# EAGLE design WattMeter_v4 (EAGLE 9.0.0)
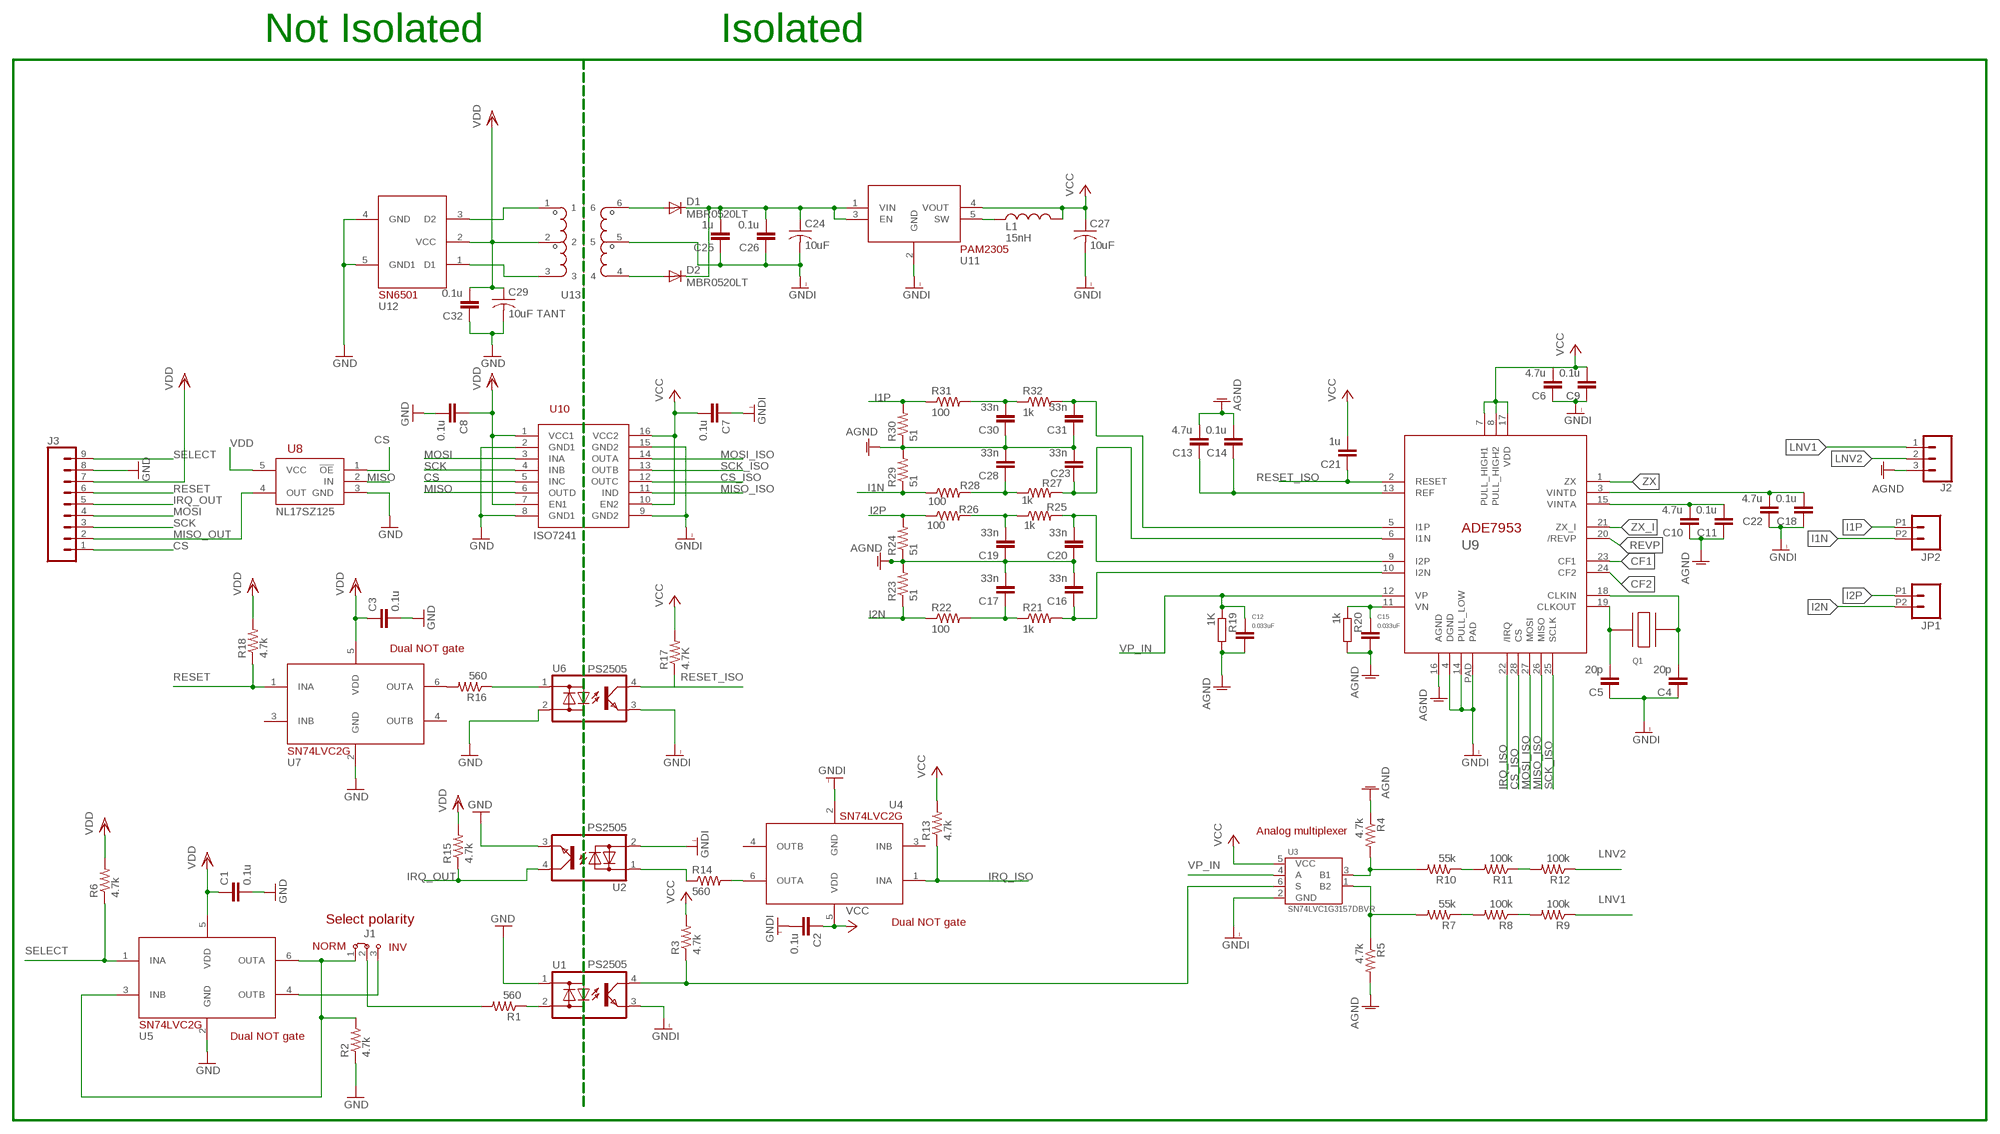
[diagram p0: schematic, sheet 1]

## Parts
C1  0.1u  0402-CAP  [0402-CAP]
C2  0.1u  0402-CAP  [0402-CAP]
C3  0.1u  0402-CAP  [0402-CAP]
C4  20p  0402-CAP  [0402-CAP]
C5  20p  0402-CAP  [0402-CAP]
C6  4.7u  0402-CAP  [0402-CAP]
C7  0.1u  0402-CAP  [0402-CAP]
C8  0.1u  0402-CAP  [0402-CAP]
C9  0.1u  0402-CAP  [0402-CAP]
C10  4.7u  0402-CAP  [0402-CAP]
C11  0.1u  0402-CAP  [0402-CAP]
C12  0.033uF  C-EUC0805K  [C0805K]
C13  4.7u  0402-CAP  [0402-CAP]
C14  0.1u  0402-CAP  [0402-CAP]
C15  0.033uF  C-EUC0805K  [C0805K]
C16  33n  0402-CAP  [0402-CAP]
C17  33n  0402-CAP  [0402-CAP]
C18  0.1u  0402-CAP  [0402-CAP]
C19  33n  0402-CAP  [0402-CAP]
C20  33n  0402-CAP  [0402-CAP]
C21  1u  0402-CAP  [0402-CAP]
C22  4.7u  0402-CAP  [0402-CAP]
C23  33n  0402-CAP  [0402-CAP]
C24  10uF  C-USC0603  [C0603]
C25  1u  0402-CAP  [0402-CAP]
C26  0.1u  0402-CAP  [0402-CAP]
C27  10uF  C-USC0603  [C0603]
C28  33n  0402-CAP  [0402-CAP]
C29  10uF TANT  C-USC0603  [C0603]
C30  33n  0402-CAP  [0402-CAP]
C31  33n  0402-CAP  [0402-CAP]
C32  0.1u  0402-CAP  [0402-CAP]
D1  MBR0520LT  [SOD123]
D2  MBR0520LT  [SOD123]
J1  JUMPER3  [1X03]
J2  CONN_03-SCREW-5MM  [SCREWTERMINAL-5MM-3]
J3  CONN_09  [1X09]
JP1  M022.54MM_SCREWTERM  [1X02_2.54_SCREWTERM]
JP2  M022.54MM_SCREWTERM  [1X02_2.54_SCREWTERM]
L1  15nH  IND0402  [0402-RES]
Q1  QUARTZ_3.58M_2PIN  [HC-49S]
R1  560  0402-RES  [0402-RES]
R2  4.7k  0402-RES  [0402-RES]
R3  4.7k  0402-RES  [0402-RES]
R4  4.7k  RESISTOR0603-RES  [0603-RES]
R5  4.7k  RESISTOR0603-RES  [0603-RES]
R6  4.7k  0402-RES  [0402-RES]
R7  55k  RESISTOR0603-RES  [0603-RES]
R8  100k  RESISTOR0603-RES  [0603-RES]
R9  100k  RESISTOR0603-RES  [0603-RES]
R10  55k  RESISTOR0603-RES  [0603-RES]
R11  100k  RESISTOR0603-RES  [0603-RES]
R12  100k  RESISTOR0603-RES  [0603-RES]
R13  4.7k  0402-RES  [0402-RES]
R14  560  0402-RES  [0402-RES]
R15  4.7k  0402-RES  [0402-RES]
R16  560  0402-RES  [0402-RES]
R17  4.7K  0402-RES  [0402-RES]
R18  4.7k  0402-RES  [0402-RES]
R19  1K  R-EU_  [C0805K@1]
R20  1k  R-EU_  [C0805K@1]
R21  1k  0402-RES  [0402-RES]
R22  100  0402-RES  [0402-RES]
R23  51  0402-RES  [0402-RES]
R24  51  0402-RES  [0402-RES]
R25  1k  0402-RES  [0402-RES]
R26  100  0402-RES  [0402-RES]
R27  1k  0402-RES  [0402-RES]
R28  100  0402-RES  [0402-RES]
R29  51  0402-RES  [0402-RES]
R30  51  0402-RES  [0402-RES]
R31  100  0402-RES  [0402-RES]
R32  1k  0402-RES  [0402-RES]
U1  PS2505  [PS2505]
U2  PS2505  [PS2505]
U3  SN74LVC1G3157DBVR  [SOT-23-6]
U4  SN74LVC  [DCKT]
U5  SN74LVC  [DCKT]
U6  PS2505  [PS2505]
U7  SN74LVC  [DCKT]
U8  NL17SZ125  [NL17SZ125]
U9  ADE7953  [28-WFQFN]
U10  ISO7241  [16-SOIC]
U11  PAM2305  [TSOT25]
U12  SN6501  [SOT-23-5]
U13  TRANSFO_3.3  [TRANSFO_3.3]

## Nets
AGND: C10.1 C11.1 C12.2 C13.2 C14.2 C15.2 C16.2 C17.2 C19.1 C20.1 C23.2 C28.2 C30.1 C31.1 J2.3 R4.1 R5.2 R19.2 R20.2 R23.2 R24.1 R29.2 R30.1 U9.16(AGND)
CF1: U9.23(CF1)
CF2: U9.24(CF2)
CS: J3.1 U8.1(!OE) U10.5(INC)
CS_ISO: U9.28(CS) U10.12(OUTC)
GND: C1.2 C3.2 C8.2 C29.2 C32.1 J3.8 R2.1 U1.1(ANODE) U2.3(EMITTER) U5.2(GND) U6.2(CATHODE) U7.2(GND) U8.3(GND) U10.2(GND1) U10.8(GND1) U12.4(GND) U12.5(GND1)
GNDI: C2.2 C4.1 C5.1 C6.1 C7.1 C9.1 C18.1 C22.1 C24.2 C25.1 C26.1 C27.2 U1.3(EMITTER) U2.2(CATHODE) U3.2(GND) U4.2(GND) U6.3(EMITTER) U9.4(DGND) U9.14(PULL_LOW) U9.PAD U10.9(GND2) U10.15(GND2) U11.2(GND) U13.5
I1N: JP2.P2 R28.1 R29.1
I1P: JP2.P1 R30.2 R31.1
I2N: JP1.P2 R22.1 R23.1
I2P: JP1.P1 R24.2 R26.1
IRQ_ISO: R13.1 U4.1(INA) U9.22(/IRQ)
IRQ_OUT: J3.5 R15.1 U2.4(COLLERTOR)
LNV1: J2.1 R9.1
LNV2: J2.2 R12.1
MISO: U8.2(IN) U10.6(OUTD)
MISO_ISO: U9.26(MISO) U10.11(IND)
MISO_OUT: J3.2 U8.4(OUT)
MOSI: J3.4 U10.3(INA)
MOSI_ISO: U9.27(MOSI) U10.14(OUTA)
N$1: C5.2 Q1.1 U9.19(CLKOUT)
N$2: C4.2 Q1.2 U9.18(CLKIN)
N$3 [ic]: C15.1 R20.1 U9.11(VN)
N$4: L1.1 U11.5(SW)
N$7: C13.1 C14.1 U9.13(REF)
N$8: C10.2 C11.2 U9.15(VINTA)
N$10: C23.1 R27.2 U9.6(I1N)
N$11: C31.2 R32.2 U9.5(I1P)
N$12: C18.2 C22.2 U9.3(VINTD)
N$13: R8.1 R9.2
N$17: J1.3 U5.4(OUTB)
N$18: D1.A U13.6
N$19: C24.1 C25.2 C26.2 D1.C D2.C U11.1(VIN) U11.3(EN)
N$20: D2.A U13.4
N$21: U12.3(D2) U13.1
N$22: R7.1 R8.2
N$23: U12.1(D1) U13.3
N$24: C30.2 R31.2 R32.1
N$25: R16.1 U6.1(ANODE)
N$26: R16.2 U7.6(OUTA)
N$27: C28.1 R27.1 R28.2
N$28: C16.1 R21.2 U9.10(I2N)
N$30: R14.2 U4.6(OUTA)
N$32: C20.2 R25.2 U9.9(I2P)
N$33: C19.2 R25.1 R26.2
N$34: C17.1 R21.1 R22.2
N$35: R11.1 R12.2
N$36: R10.1 R11.2
N$37: R5.1 R7.2 U3.1(B2)
N$38: R4.2 R10.2 U3.3(B1)
N$39: R14.1 U2.1(ANODE)
N$40: J1.1 R2.2 U5.3(INB) U5.6(OUTA)
N$42: J1.2 R1.2
N$43: R1.1 U1.2(CATHODE)
RESET: J3.6 R18.1 U7.1(INA)
RESET_ISO: C21.1 R17.1 U6.4(COLLERTOR) U9.2(RESET)
REVP: U9.20(/REVP)
SCK: J3.3 U10.4(INB)
SCK_ISO: U9.25(SCLK) U10.13(OUTB)
SELECT: J3.9 R6.1 U5.1(INA)
SETPHASE: R3.1 U1.4(COLLERTOR) U3.6(S)
V2P [ic]: C12.1 R19.1 U9.12(VP)
VCC: C2.1 C6.2 C7.2 C9.2 C21.2 C27.1 L1.2 R3.2 R13.2 R17.2 U3.5(VCC) U4.5(VDD) U9.7(PULL_HIGH1) U9.8(PULL_HIGH2) U9.17(VDD) U10.10(EN2) U10.16(VCC2) U11.4(VOUT)
VDD: C1.1 C3.1 C8.1 C29.1 C32.2 J3.7 R6.2 R15.2 R18.2 U5.5(VDD) U7.5(VDD) U8.5(VCC) U10.1(VCC1) U10.7(EN1) U12.2(VCC) U13.2
VP_IN: U3.4(A)
ZX: U9.1(ZX)
ZX_I: U9.21(ZX_I)
Unconnected: U4.3(INB) U4.4(OUTB) U7.3(INB) U7.4(OUTB)

## Notes on the sheet
- Not Isolated | Isolated
- ISO7241
- Dual NOT gate
- Analog multiplexer
- Select polarity | Dual NOT gate
- NORM | INV
- Dual NOT gate

## Library data of the parts
C1-C11 C13 C14 C16-C23 C25 C26 C28 C30-C32 = Nizanlib:0402-CAP
C12 C15 = resistor:C-EU: CAPACITOR, European symbol
C24 C27 C29 = resistor:C-US: CAPACITOR, American symbol
D1 D2 = diode:MBR0520LT: SCHOTTKY BARRIER RECTIFIER Source: http://onsemi.com .. MBR0520LT1-D.pdf
J1 = Erica:JUMPER3
J2 = SparkFun-Connectors:CONN_03: Multi connection point. Often used as Generic Header-pin footprint for 0.1 inch spaced/style header connections On any of the 0.1 inch spaced packages, you can populate with these: Break Away Headers - Straight <https://www.sparkfun.com/products/116> (PRT-00116) Break Away Male Headers - Right Angle <https://www.sparkfun.com/products/553> (PRT-00553) Female Headers <https://www.sparkfun.com/products/115> (PRT-00115) Break Away Headers - Machine Pin <https://www.sparkfun.com/products/117> (PRT-00117) Break Away Female Headers - Swiss Machine Pin <https://www.sparkfun.com/products/743> (PRT-00743) Stackable Header - 3 Pin (Female, 0.1") <https://www.sparkfun.com/products/13875> (PRT-13875) For SCREWTERMINALS and SPRING TERMINALS visit here: Screw Terimnals on SparkFun.com <https://www.sparkfun.com/search/results?term=Screw+Terminals> (5mm/3.5mm/2.54mm spacing) This device is also useful as a general connection point to wire up your design to another part of your project. Our various solder wires solder well into these plated through hole pads. Hook-Up Wire - Assortment (Stranded, 22 AWG) <https://www.sparkfun.com/products/11375> (PRT-11375) Hook-Up Wire - Assortment (Solid Core, 22 AWG) <https://www.sparkfun.com/products/11367> (PRT-11367) View the entire wire category on our website here <https://www.sparkfun.com/categories/141> Special notes: Molex polarized connector foot print use with SKU : PRT-08232 with associated crimp pins and housings.; PROD_ID: CONN-10134; SF_SKU: PRT-08433
J3 = SparkFun-Connectors:CONN_09: Multi connection point. Often used as Generic Header-pin footprint for 0.1 inch spaced/style header connections On any of the 0.1 inch spaced packages, you can populate with these: Break Away Headers - Straight <https://www.sparkfun.com/products/116> (PRT-00116) Break Away Male Headers - Right Angle <https://www.sparkfun.com/products/553> (PRT-00553) Female Headers <https://www.sparkfun.com/products/115> (PRT-00115) Break Away Headers - Machine Pin <https://www.sparkfun.com/products/117> (PRT-00117) Break Away Female Headers - Swiss Machine Pin <https://www.sparkfun.com/products/743> (PRT-00743) For SCREWTERMINALS and SPRING TERMINALS visit here: Screw Terimnals on SparkFun.com <https://www.sparkfun.com/search/results?term=Screw+Terminals> (5mm/3.5mm/2.54mm spacing) This device is also useful as a general connection point to wire up your design to another part of your project. Our various solder wires solder well into these plated through hole pads. Hook-Up Wire - Assortment (Stranded, 22 AWG) <https://www.sparkfun.com/products/11375> (PRT-11375) Hook-Up Wire - Assortment (Solid Core, 22 AWG) <https://www.sparkfun.com/products/11367> (PRT-11367) View the entire wire category on our website here <https://www.sparkfun.com/categories/141> Special notes: Molex polarized connector foot print use with SKU : PRT-08231 with associated crimp pins and housings. 1MM SMD Version SKU: PRT-10208 NOTES ON THE VARIANTS LOCK and LOCK_LONGPADS... This footprint was designed to help hold the alignment of a through-hole component (i.e. 6-pin header) while soldering it into place. You may notice that each hole has been shifted either up or down by 0.005 of an inch from it's more standard position (which is a perfectly straight line). This slight alteration caused the pins (the squares in the middle) to touch the edges of the holes. Because they are alternating, it causes a "brace" to hold the component in place. 0.005 has proven to be the perfect amount of "off-center" position when using our standard breakaway headers. Although looks a little odd when you look at the bare footprint, once you have a header in there, the alteration is very hard to notice. Also,if you push a header all the way into place, it is covered up entirely on the bottom side.
JP1 JP2 = SparkFun-Connectors:M02: Standard 2-pin 0.1" header. Use with - straight break away headers ( PRT-00116) - right angle break away headers (PRT-00553) - swiss pins (PRT-00743) - machine pins (PRT-00117) - female headers (PRT-00115) Molex polarized connector foot print use with: PRT-08233 with associated crimp pins and housings. 2.54_SCREWTERM for use with PRT-10571. 3.5mm Screw Terminal footprints for PRT-08084 5mm Screw Terminal footprints for use with PRT-08432
L1 = Nizanlib:IND0402
Q1 = CalPlug:QUARTZ_3.58M_2PIN; DIGIKEY: http://www.digikey.com/product-detail/en/txc-corporation/9C-3.579545MBBK-T/887-2450-1-ND/4475440
R1-R3 R6 R13-R18 R21-R32 = Nizanlib:0402-RES
R4 R5 R7-R12 = SparkFun:RESISTOR: Resistor Basic schematic elements and footprints for 0603, 1206, and PTH 1/10th watt (small) resistors.
R19 R20 = resistor:R-EU_: RESISTOR, European symbol
U1 U2 U6 = wattmeter:PS2505
U3 = TI:SN74LVC1G3157
U4 U5 = Damien_divers:SN74LVC
U7 = Damien_divers:SN74LVC; SPICEPREFIX: X
U8 = wattmeter:NL17SZ125
U9 = CalPlug:ADE7953
U10 = wattmeter:ISO7241
U11 = Damien_regulator:PAM2305
U12 = CalPlug:SN6501
U13 = Damien_power:TRANSFO_3.3

## Net classes
0 default: clearance 0.205 mm
1 HIGHVOLTAGE: width 0.254 mm, drill 0.508 mm, clearance 2.413 mm to class 0, clearance 0.152 mm
2 ic: width 0.152 mm, drill 0.305 mm, clearance 0.205 mm to class 0, clearance 2.413 mm to class 1, clearance 0.205 mm

## Board
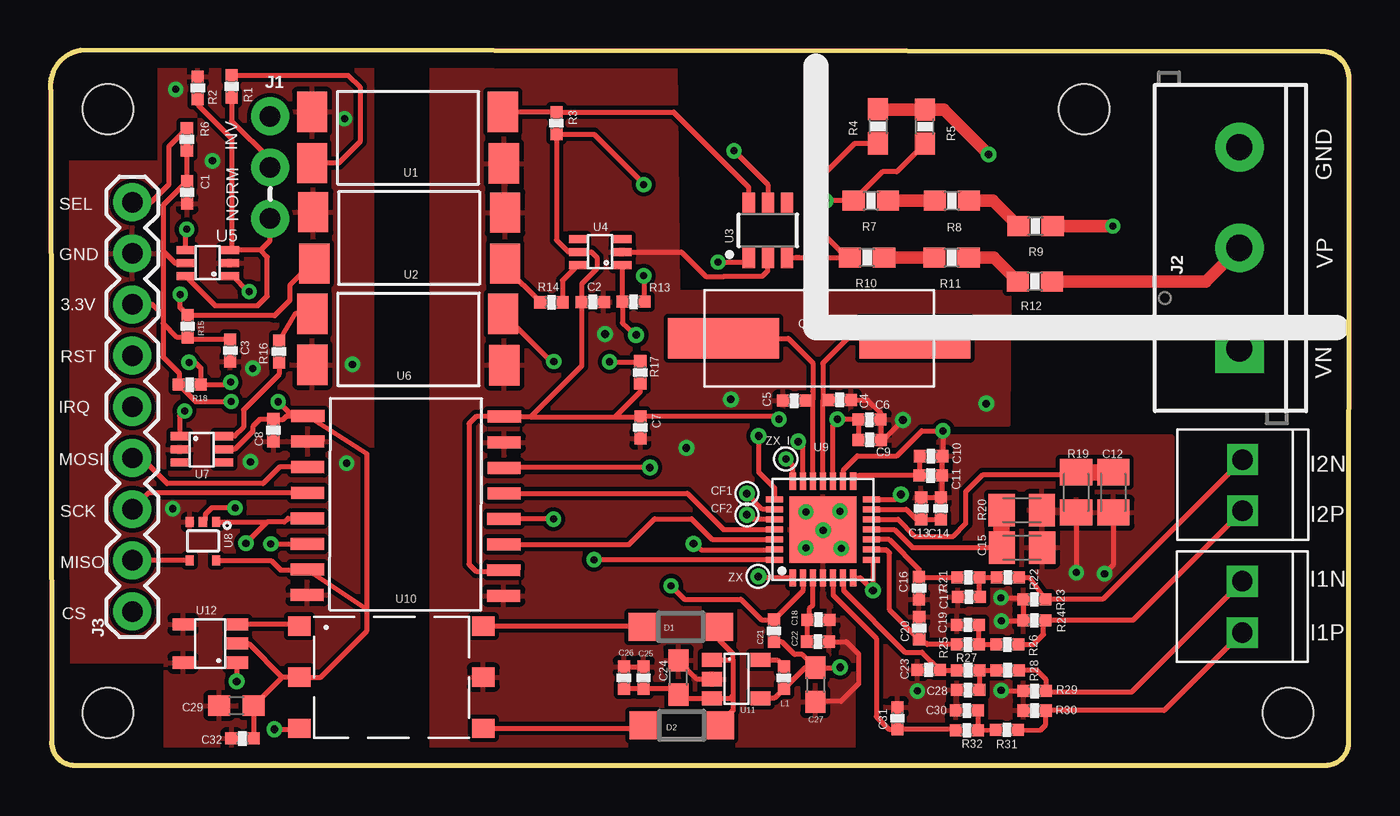
[diagram p1: board, top side]
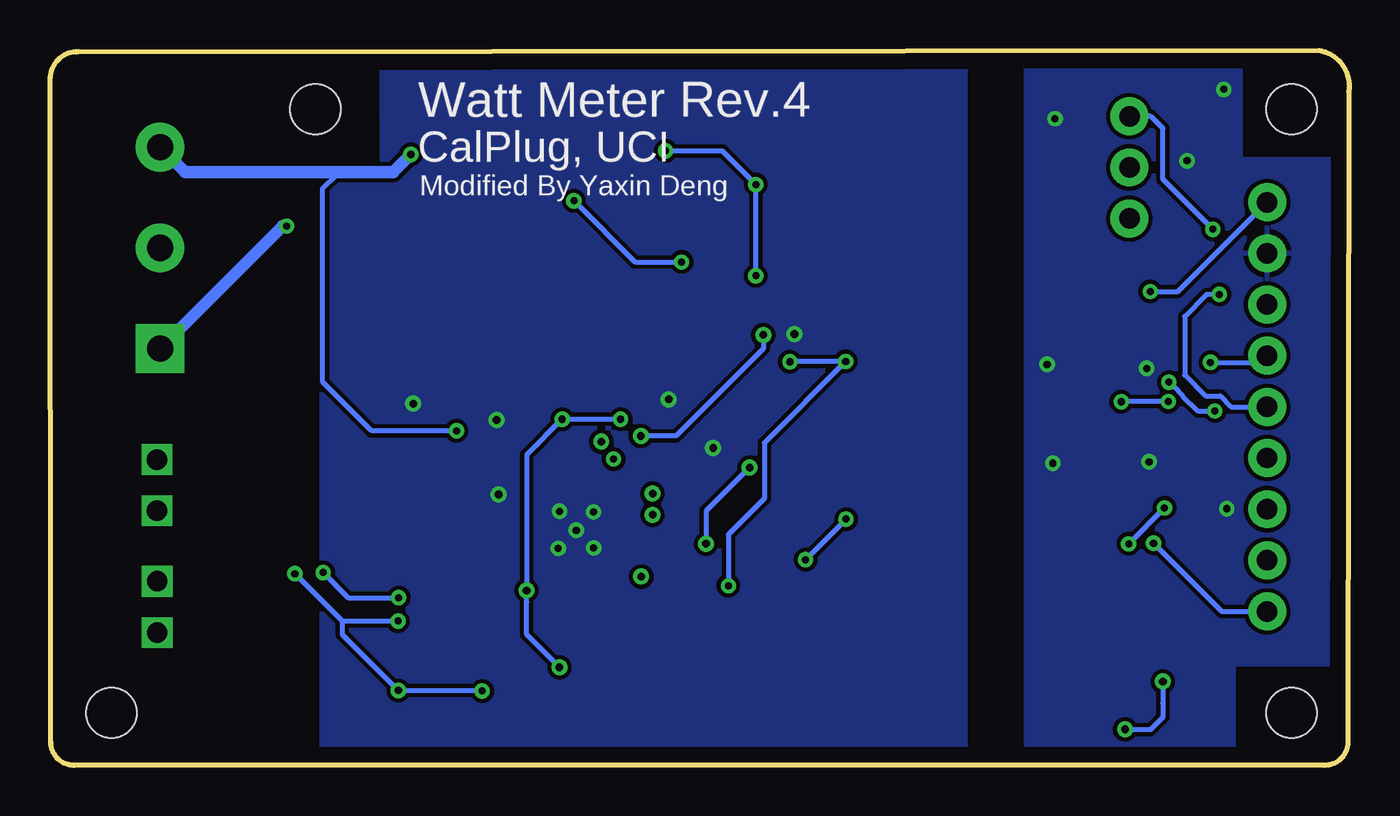
[diagram p2: board, bottom side, seen from below]

Size 64.47 x 35.5 mm. Coordinates in mm from the lower left corner, seen from the top.
Outline: 1.21,0 63.29,0 arc90 64.45,1.16 64.47,34.15 arc90 63.07,35.44 1.5,35.5 arc90 0.02,33.46 0.06,1.15 arc90 1.21,0
Copper layers (1*16): Top 0.035mm / dielectric 1.5mm / Bottom 0.035mm
Design rules "default *": minimum track width 10mil, minimum drill 0.3mm, track to track 8mil, track to pad 8mil, pad to pad 8mil, via to via 8mil, smd to smd 8mil, copper to edge 30mil, drill to drill 8mil, minimum pad ring 10mil, minimum via ring 8mil, stop-mask expansion 4mil, vias tented up to drill 0mil, thermal gap 10mil
Holes 2.5 mm at 2.85,32.58 2.85,2.61 51.31,32.58 61.43,2.61

### Footprints (pad centres in the part's own frame; a part is rotated, then mirrored left to right if it is on the bottom)
0402-CAP = smd 0.6 x 0.6: 1 -0.55,0; 2 0.55,0
C0805K = smd 1.3 x 1.6: 1 -1,0; 2 1,0
C0603 = smd 1.1 x 1: 1 -0.85,0; 2 0.85,0
SOD123 = smd 1.4 x 1.4: A 1.9,0; C -1.9,0
1X03 = drill 1.016 pad 1.88: 1 0,0; 2 2.54,0; 3 5.08,0
SCREWTERMINAL-5MM-3 = drill 1.3 pad 2.413 square: 1 0,0 | drill 1.3 pad 2.413: 2 5,0; 3 10,0
1X09 = drill 1.016 pad 1.88: 1 0,0; 2 2.54,0; 3 5.08,0; 4 7.62,0; 5 10.16,0; 6 12.7,0; 7 15.24,0; 8 17.78,0; 9 20.32,0
1X02_2.54_SCREWTERM = drill 1.016 square: P1 2.54,0; P2 0,0
0402-RES = smd 0.6 x 0.6: 1 -0.55,0; 2 0.55,0
HC-49S = smd 5.5 x 2: 1 -4.75,0; 2 4.75,0
0603-RES = smd 1.1 x 1: 1 -0.85,0; 2 0.85,0
C0805K@1 = smd 1.3 x 1.6: 1 -1,0; 2 1,0
PS2505 = smd 1.5 x 2: 1 0.381,3.575; 2 0.381,1.035; 3 9.906,1.016; 4 9.854,3.575
SOT-23-6 = smd 1.05 x 0.6: 1 -1.35,0.95; 2 -1.35,0; 3 -1.35,-0.95; 4 1.35,-0.95; 5 1.35,0; 6 1.35,0.95
DCKT = smd 0.9 x 0.4: 1 0,1.3; 2 0,0.65; 3 0,0; 4 2.2,0; 5 2.2,0.65; 6 2.2,1.3
NL17SZ125 = smd 0.5 x 0.4: 1 0,1.3; 2 0,0.65; 3 0,0; 4 1.9,0; 5 1.9,1.3
28-WFQFN = smd 0.85 x 0.3: 1 -2.4,1.5; 2 -2.4,1; 3 -2.4,0.5; 4 -2.4,0; 5 -2.4,-0.5; 6 -2.4,-1; 7 -2.4,-1.5; 15 2.4,-1.5; 16 2.4,-1; 17 2.4,-0.5; 18 2.4,0; 19 2.4,0.5; 20 2.4,1; 21 2.4,1.5 | smd 0.3 x 0.85: 8 -1.5,-2.4; 9 -1,-2.4; 10 -0.5,-2.4; 11 0,-2.4; 12 0.5,-2.4; 13 1,-2.4; 14 1.5,-2.4; 22 1.5,2.4; 23 1,2.4; 24 0.5,2.4; 25 0,2.4; 26 -0.5,2.4; 27 -1,2.4; 28 -1.5,2.4 | smd 3.3 x 3.3: PAD 0,0
16-SOIC = smd 1.65 x 0.6: 1 0,8.89; 2 0,7.62; 3 0,6.35; 4 0,5.08; 5 0,3.81; 6 0,2.54; 7 0,1.27; 8 0,0; 9 9.75,0; 10 9.75,1.27; 11 9.75,2.54; 12 9.75,3.81; 13 9.75,5.08; 14 9.75,6.35; 15 9.75,7.62; 16 9.75,8.89
TSOT25 = smd 0.7 x 1: 1 0,0; 2 0.95,0; 3 1.9,0; 4 1.9,2.4; 5 0,2.4
SOT-23-5 = smd 0.6 x 1.05: 1 0,0; 2 0.95,0; 3 1.9,0; 4 1.9,2.7; 5 0,2.7
TRANSFO_3.3 = smd 1.12 x 0.96: 1 0,5.08; 2 0,2.54; 3 0,0; 4 9.14,0; 5 9.14,2.54; 6 9.14,5.08

### Placement (x,y rotation side)
C1  6.79,28.45 270 top
C2  26.92,23.01 0 top
C3  8.93,20.59 270 top
C4  39.19,18.14 180 top
C5  36.93,18.11 0 top
C6  40.66,17.17 180 top
C7  29.29,16.78 90 top
C8  11.07,16.63 270 top
C9  40.67,16.16 180 top
C10  43.72,15.35 180 top
C11  43.7,14.39 180 top
C12  52.76,13.55 270 top
C13  43.23,12.75 90 top
C14  44.2,12.75 90 top
C15  48.23,10.81 0 top
C16  43.12,8.8 270 top
C17  45.6,8.36 180 top
C18  38.13,7.23 180 top
C19  45.54,6.97 0 top
C20  43.13,6.81 270 top
C21  35.92,6.68 270 top
C22  38.11,6.14 180 top
C23  43.6,4.74 180 top
C24  31.18,4.36 90 top
C25  29.44,4.35 270 top
C26  28.47,4.35 270 top
C27  37.97,4 270 top
C28  45.55,3.74 180 top
C29  9.24,2.97 180 top
C30  45.49,2.72 0 top
C31  42.05,2.34 270 top
C32  9.54,1.33 0 top
D1  31.29,6.88 180 top
D2  31.34,1.99 180 top
J1  10.91,27.15 90 top
J2  59.03,20.69 90 top
J3  4.07,7.64 90 top
JP1  59.18,15.18 270 top
JP2  59.17,9.13 270 top
L1  36.41,4.35 270 top
Q1  38.16,21.2 0 top
R1  9,33.71 270 top
R2  7.32,33.63 270 top
R3  25.12,31.88 270 top
R4  41.08,31.73 270 top
R5  43.41,31.71 90 top
R6  6.78,31.08 270 top
R7  40.73,28.03 180 top
R8  44.75,28.03 180 top
R9  48.9,26.77 180 top
R10  40.54,25.21 180 top
R11  44.74,25.2 180 top
R12  48.87,24.03 180 top
R13  28.95,23.02 0 top
R14  24.87,22.99 0 top
R15  6.82,21.8 270 top
R16  11.35,20.54 270 top
R17  29.28,19.51 270 top
R18  6.91,18.9 180 top
R19  50.92,13.55 270 top
R20  48.22,12.67 0 top
R21  45.57,9.33 180 top
R22  47.53,9.33 180 top
R23  48.84,8.24 180 top
R24  48.84,7.2 0 top
R25  45.54,6 180 top
R26  47.51,6 180 top
R27  45.56,4.72 180 top
R28  47.52,4.72 180 top
R29  48.86,3.69 180 top
R30  48.86,2.72 0 top
R31  47.48,1.76 180 top
R32  45.49,1.74 180 top
U1  12.61,28.87 0 top
U2  22.96,28.48 180 top
U3  35.62,26.57 90 top
U4  28.39,26.14 180 top
U5  8.91,25.58 180 top
U6  12.62,18.85 0 top
U7  6.42,15.04 0 top
U8  6.92,12.08 270 top
U9  38.35,11.71 90 top
U10  12.75,8.45 359.8 top
U11  32.85,5.23 270 top
U12  9.29,5.1 90 top
U13  12.35,1.84 0 top

### Tracks (layer width: path | path; a pad name or v marks a point on that pad's centre or on a via)
AGND  (via drill 0.35)
  Top 0.254: 50.8,12.67 R19.2 v50.92,9.57 v50.93,9.57 | C13.2 C14.2 44.25,13.35 C11.1 44.27,14.4 C10.1 | 39.33,14.09 U9.16 39.37,14.13 39.37,14.67 40.06,15.36 42.02,15.36 43.26,16.61 v44.31,16.61 44.31,15.39 C10.1 | 44.29,15.37 C10.1 | C15.2 | v47.18,8.32 48.21,8.32 R23.2 R24.1 48.25,7.16 v47.21,7.16 | C12.2 52.76,9.94 v52.33,9.51 | v47.2,3.71 47.22,3.69 R29.2
  Top 0.61: R4.1 41.09,32.56 R5.2 44.35,32.56 v46.58,30.33
  Bottom 0.254: v44.31,16.61 48.52,16.61 50.95,19.04 50.95,28.66 50.3,29.31 50.3,29.44 | v50.93,9.57 49.68,8.32 v47.18,8.32 | v52.33,9.51 49.98,7.16 | 49.98,7.16 v47.21,7.16 | 49.98,7.16 49.98,6.5 v47.2,3.71 43.07,3.71 v43.04,3.69
  Bottom 0.61: v46.58,30.33 47.47,29.44 50.3,29.44 57.78,29.44 J2.3
  pour Top: 40.5,0.92 40.5,12.47 44.35,16.32 55.65,16.32 55.68,16.29 55.68,1.01 55.59,0.92
CF1  (via drill 0.38)
  Top 0.254: U9.23 35.36,12.71 v34.57,13.49
CF2  (via drill 0.38)
  Top 0.254: U9.24 34.81,12.21 v34.57,12.44
CS  (via drill 0.35)
  Top 0.254: U8.1 8.87,12.07 10.75,12.07 | U10.5 11.79,12.26 11.61,12.07 10.75,12.07 | 10.75,12.07 v9.71,11.03
  Bottom 0.254: v9.71,11.03 6.32,7.64 J3.1
CS_ISO  (via drill 0.35)
  Top 0.254: v26.99,10.21 35.23,10.21 35.24,10.21 35.26,10.21 U9.28 | v24.98,12.22 U10.12
  Bottom 0.254: v26.99,10.21 v24.98,12.22
GND  (via drill 0.35)
  Top 0.254: 8.46,2.72 C29.2 | 12.77,16.08 U10.2 | U6.2 12.87,19.75
  other vias: 9.93,15.07 6.08,12.74 14.99,19.91 14.71,15 10.05,19.71 8.05,30.02 6.22,33.56 14.6,32.11
  pour Top: 5.74,0.28 5.74,5.13 5.72,5.15 0.41,5.15 0.41,29.91 0.39,29.93 5.43,29.93 5.45,29.95 5.45,35.11 5.41,35.16 15.91,35.16 15.95,35.11 15.95,0.3 15.93,0.28 15.91,0.26 5.7,0.26
  pour Bottom: 5.73,0.58 5.73,4.98 5.74,5.05 0.47,5.05 0.47,30.05 0.5,30.08 5.37,30.08 5.39,30.05 5.39,35.13 5.37,35.16 15.97,35.16 16.04,35.09 16.04,0.53 16.08,0.49 5.67,0.49 5.65,0.46
GNDI  (via drill 0.35, 0.38)
  Top 0.254: 38.68,6.16 C22.1 39.51,6.14 40.12,5.53 40.12,4.04 39.26,3.17 37.99,3.17 C27.2 | C26.1 C25.1 | U11.2 32.11,4.28 C24.2 | U4.2 31.33,25.49 32.54,24.28 33.43,24.28 33.44,24.28 35.34,24.28 35.62,24.56 U3.2 | C7.1 | v42.32,17.14 41.29,16.09 C9.1 41.22,17.15 C6.1 41.21,17.51 40.57,18.14 C4.1 | U9.14 41.98,13.21 v42.23,13.45
  other vias: 31.57,15.76 46.46,17.96 39.19,12.62 39.26,10.78 38.36,11.67 37.5,10.8 37.51,12.58 33.78,18.17 27.54,21.41
  pour Bottom: 19.1,0.66 19.22,0.6 19.17,0.66
  pour Top: 18.95,0.61 18.95,34.87 18.93,34.89 30.96,34.89 31.02,34.95 31.13,23.49 47.59,23.49 47.53,16.93 47.52,16.92 43.19,16.92 39.84,13.57 39.84,0.47 18.96,0.47 18.94,0.48
  pour Bottom: 48.02,34.61 48.01,29.55 51.01,29.55 51.02,0.57 19.05,0.57 19.05,34.7 48.03,34.7 48.03,34.58
I1N
  Top 0.254: R28.1 48.96,4.72 49.41,4.27 R29.1 49.41,3.63 53.66,3.63 JP2.P2
I1P
  Top 0.254: R30.2 49.41,2.02 49.14,1.75 R31.1 | R30.2 49.45,2.76 | JP2.P1 55.3,2.72 R30.2
I2N
  Top 0.254: R22.1 48.6,9.33 R23.1 52.24,8.24 JP1.P2
I2P
  Top 0.254: R26.1 48.8,6 49.3,6.5 49.3,7.11 R24.2 53.74,7.2 JP1.P1
IRQ_ISO  (via drill 0.38)
  Top 0.254: R13.1 28.4,22.75 | 28.4,22.75 28.4,21.97 v29.08,21.37 | U4.1 28.39,22.76 28.4,22.75 | v35.16,16.36 35.16,14.56 35.95,13.76 U9.22
  Bottom 0.254: v29.08,21.37 29.08,20.7 33.43,16.36 v35.16,16.36
IRQ_OUT  (via drill 0.35)
  Top 0.254: U2.4 12.96,24.91 11.89,23.84 11.89,23.09 11.12,22.32 11.09,22.35 R15.1 6.44,22.72 v6.44,23.38
  Bottom 0.254: v6.44,23.38 7.08,23.38 8.17,22.29 8.17,19.37 7.14,18.34 6.4,18.34 5.87,17.8 J3.5
LNV1  (via drill 0.35)
  Top 0.61: R9.1 v52.74,26.77 52.76,26.75
  Bottom 0.61: J2.1 52.95,26.77 v52.74,26.77
LNV2
  Top 0.61: J2.2 57.36,24.03 R12.1
MISO  (via drill 0.35)
  Top 0.254: U8.2 7.69,12.19 7.69,12.46 8.01,12.78 v9.16,12.78 | v10.94,11 U10.6
  Bottom 0.254: v9.16,12.78 v10.94,11
MISO_ISO
  Top 0.254: 35.53,11.21 U9.26 35.94,11.22 32.85,11.22 31.83,12.24 30,12.24 28.72,10.96 U10.11
MISO_OUT
  Top 0.254: U8.4 4.08,10.17 J3.2
MOSI
  Top 0.254: U10.3 11.38,14.8 10.56,13.99 5.8,13.99 4.53,15.26 J3.4
MOSI_ISO  (via drill 0.38)
  Top 0.254: v31.92,11 31.99,11 32.33,10.69 35.37,10.69 35.39,10.69 35.93,10.69 U9.27 | U10.14 22.55,14.78 v29.76,14.78
  Bottom 0.254: v29.76,14.78 31.92,12.62 v31.92,11
N$1
  Top 0.254: 37.85,18.16 37.85,18.58 37.85,18.71 37.85,19.98 36.63,21.2 Q1.1 | U9.19 37.85,18.16 | C5.2 37.8,18.11 37.85,18.16
N$2
  Top 0.254: U9.18 38.35,18.11 | C4.2 38.39,18.14 38.35,18.11 | Q1.2 39.58,21.2 38.33,19.96 38.35,19.94 38.35,18.11
N$3
  Top 0.254: U9.11 41.89,11.71 42.79,10.81 C15.1 | 47.03,12.48 R20.1
  Top 0.813: R20.1 C15.1
N$4
  Top 0.254: U11.5 36.08,5.23 L1.1
N$7
  Top 0.254: U9.13 42.49,12.71 43.01,12.19 C13.1 C14.1
N$8
  Top 0.254: C10.2 43.15,15.33 C11.2 40.13,14.38 U9.15
N$10
  Top 0.254: R27.2 44.17,4.72 C23.1 43.27,5.62 42.43,5.62 39.37,8.67 39.37,9.29 U9.6
N$11
  Top 0.254: U9.5 38.85,8.45 41,6.3 41,2.41 41.62,1.79 C31.2 44.89,1.79 R32.2
N$12
  Top 0.254: U9.3 37.85,7.95 37.66,7.76 37.66,7.31 C18.2 37.56,7.21 C22.2
N$13
  Top 0.61: R8.1 46.79,28.03 R9.2
N$17  (via drill 0.35)
  Top 0.254: U5.4 6.71,26.57 v6.76,26.62
  Bottom 0.254: v6.76,26.62 9.24,29.1 9.24,31.63 9.84,32.23 J1.3
N$18
  Top 0.254: U13.6 29.39,6.92
  Top 0.406: 29.39,6.92 D1.A
N$19
  Top 0.254: C26.2 C25.2 30.89,3.8 C24.1 | 31.36,3.33 U11.3 33.75,3.33 33.89,3.47 | D2.C 33.21,1.77 arc-90 33.2,1.78 | 33.19,5.24 arc90 U11.1 33.88,5.23 33.89,5.22 | D2.C 33.26,2.01 | D2.C 33.2,2.03 33.89,2.72 33.89,3.47 | D1.C 33.19,6.24 33.89,5.54 33.89,5.22 | 33.89,5.22 33.89,3.47
  Top 0.406: C24.1 31.36,3.33
N$20
  Top 0.254: U13.4 29.29,1.84 D2.A
N$21
  Top 0.254: U13.1 12.27,7 U12.3
N$22
  Top 0.254: R7.1 41.64,27.97
  Top 0.61: R7.1 R8.2
N$23  (via drill 0.38)
  Top 0.254: v11.12,1.79 12.3,1.79 U13.3 | U12.1 9.25,5.06 v9.25,4.16
  Bottom 0.254: v9.25,4.16 9.25,3.08 9.25,2.38 9.86,1.77 11.1,1.77 v11.12,1.79
N$24
  Top 0.254: R31.2 R32.1 C30.2
N$25
  Top 0.254: U6.1 12.15,22.43 R16.1
N$26
  Top 0.254: R16.2 11.35,19.41 9.59,17.65 9.59,16.78 9.15,16.34 U7.6
N$27
  Top 0.254: R28.2 R27.1 C28.1
N$28
  Top 0.254: C16.1 43.14,9.33 R21.2 | U9.10 41.64,11.21 43.12,9.73 C16.1 | 43.12,9.51 C16.1
N$30
  Top 0.254: U4.6 25.42,24.07 R14.2
N$32
  Top 0.254: 40.77,10.69 U9.9 41.49,10.71 41.51,10.69 | 43.12,6.28 C20.2 | R25.2 43.54,6 43.46,6.08 43.31,6.08 C20.2 | C20.2 41.66,7.73 41.66,10.54 41.51,10.69 | 40.77,10.69 41.51,10.69
N$33
  Top 0.254: C19.2 R25.1 R26.2
N$34
  Top 0.254: C17.1 46.12,8.49 R21.1 R22.2
N$35
  Top 0.61: 45.62,25.17 R11.1 46.84,25.2 R12.2
N$36
  Top 0.61: R11.2 R10.1
N$37  (via drill 0.35)
  Top 0.254: 39.84,28.03 R7.2 | R5.1 42.02,29.47 41.32,29.47 R7.2 | R7.2 v38.49,28.03 v38.48,28.03 | v33.14,24.99 34.44,24.99 U3.1
  Bottom 0.254: v38.48,28.03 35.44,24.99 v33.14,24.99
N$38
  Top 0.254: U3.3 37.03,25.22 | 37.03,25.22 39.54,25.21 | 39.54,25.21 R10.2 | R4.2 39.92,30.88 37.7,28.66 37.7,27.05 39.54,25.21 | 37.17,25.22 37.03,25.22
N$39
  Top 0.254: U2.1 22.61,24.71 R14.1
N$40
  Top 0.254: 10.44,25.58 9,25.58 | 9,25.58 U5.3 | U5.6 8.17,22.82 10.29,22.82 10.77,23.3 10.77,25.25 10.44,25.58 | R2.2 7.33,32.79 9,31.12 9,25.58 | 10.44,25.58 10.91,26.05 J1.1
N$42
  Top 0.254: R1.2 9,32 10.91,30.09 J1.2
N$43
  Top 0.254: U1.2 14.31,29.9 15.37,30.96 15.37,33.69 14.79,34.26 R1.1
RESET  (via drill 0.35)
  Top 0.254: v8.95,19.02 8.83,18.9 R18.1 7.48,18.92 7.47,18.93 7.47,19.73 7.19,20.01 v6.88,20.01 | v6.66,17.59 6.42,17.35 U7.1
  Bottom 0.254: v6.88,20.01 4.4,20.01 J3.6 | v6.66,17.59 7.52,17.59 8.27,18.34 8.27,18.36 8.68,18.77 8.7,18.77 v8.95,19.02
RESET_ISO  (via drill 0.35)
  Top 0.254: v24.99,20.05 24.85,20.05 U6.4 | v27.76,20.04 29.26,20.04 R17.1 | v30.81,8.91 31.47,8.25 34.27,8.25 35.29,7.23 C21.1 37.35,8.66 U9.2
  Bottom 0.254: v27.76,20.04 27.74,20.05 v24.99,20.05 29.03,16.01 29.03,13.24 30.81,11.46 v30.81,8.91
REVP  (via drill 0.38)
  Top 0.254: U9.20 37.35,15.84 v37.12,16.07
SCK
  Top 0.254: U10.4 10.76,13.53 10.75,13.53 5.61,13.53 5.6,13.53 4.89,13.53 J3.3
SCK_ISO
  Top 0.254: U9.25 33.41,11.71 31.62,13.5 U10.13 22.69,13.33
SELECT  (via drill 0.35)
  Top 0.254: 9.66,23.53 9.79,23.53 | 9.79,23.53 v9.87,23.53 | J3.9 5,27.96 5.88,28.84 5.88,30.73 R6.1 | U5.1 9.04,24.28 9.79,23.53
  Bottom 0.254: v9.87,23.53 8.5,23.53 J3.9
SETPHASE
  Top 0.254: U1.4 R3.1 30.94,32.43 34.67,28.7 U3.6
V2P
  Top 0.254: U9.12 42.08,12.21 42.9,11.37 44.82,11.37 45.45,12 45.45,13.6 46.29,14.44 50.81,14.44 R19.1
  Top 0.813: R19.1 C12.1
VCC  (via drill 0.35, 0.38)
  Top 0.254: 35.73,6.13 C21.2 | C21.2 36.31,6.13 36.94,5.5 37.32,5.5 C27.1 | 35.75,6.13 C21.2 | 39.85,9.04 U9.7 40.2,9.31 v40.83,8.68 40.83,10.13 U9.8 | 36.41,3.83 L1.2 | C27.1 38.93,4.85 v39.2,4.86 | U10.10 22.66,9.68 22.61,9.63 21.14,9.63 20.78,9.99 20.78,16.97 21.12,17.31 U10.16 22.54,17.3 23.83,17.3 | 26.4,23.04 C2.1 | v33.93,30.51 35.62,28.83 U3.5 | L1.2 35.94,3.33 U11.4 | C27.1 37.46,4.85 L1.2 | 39.14,17.18 v39.06,17.18 | 39.14,17.18 38.85,16.9 U9.17 | C9.2 40.12,17.15 C6.2 39.15,17.17 39.14,17.18 | R13.2 29.5,24.26 v29.45,24.31 | 29.37,28.96 26.99,31.33 R3.2 25.12,26.09 25.72,25.49 U4.5 26.86,25.49 27.13,25.22 27.14,25.22 27.14,24.66 26.97,24.5 26.88,24.41 26.37,23.9 C2.1 | 29.37,28.96 29.47,28.86 | C2.1 26.37,19.84 23.83,17.3 | 23.83,17.3 28.03,17.3 | 28.03,17.3 29.25,17.3 C7.2 35.92,17.33 36.06,17.18 v36.17,17.18 | R17.2 29.28,18.55 28.03,17.3 | 29.37,28.96 29.37,28.92 v29.45,28.84
  Bottom 0.254: v40.83,8.68 40.83,8.1 40.84,8.09 | v39.2,4.86 40.83,6.49 v40.83,8.68 | v36.17,17.18 36.28,17.18 v39.06,17.18 40.83,15.41 v40.83,8.68 | v29.45,24.31 v29.45,28.84 31.11,30.5 33.92,30.5 v33.93,30.51
VDD  (via drill 0.35)
  Top 0.254: 15.72,7.74 15.72,6.68 13.42,4.38 U13.2 11.5,4.38 | 15.72,7.74 15.72,15.46 U10.1 12.02,17.35 | J3.7 5.07,22.88 5.58,22.41 5.6,22.43 | U10.7 12.85,9.66 | 12.85,9.66 15.72,7.74 | 5.6,25.54 5.6,22.43 | U8.5 10.95,10.17 11.42,9.7 12.81,9.7 12.85,9.66 | R6.2 C1.1 5.6,27.8 5.6,25.54 | 5.6,25.54 6.2,24.93 U5.5 | C8.1 11.56,17.18 11.73,17.35 12.02,17.35 | 11.04,17.14 C8.1 | v8.98,18.06 7.2,18.06 R18.2 6.39,18.93 6.39,19.48 5.6,20.27 5.6,21.96 | 11.09,17.2 C8.1 | 5.6,22.43 5.6,21.96 | 5.6,21.96 6.31,21.25 R15.2 6.92,21.14 C3.1 | C8.1 10.43,17.18 10.42,17.19 10.05,16.82 10.05,16.59 9.15,15.69 U7.5 | 11.5,4.38 C29.1 10.09,1.58 C32.2 | U12.2 9.83,6.05 11.5,4.38 | v11.31,18.05 12.02,17.35
  Bottom 0.254: v8.98,18.06 11.3,18.06 v11.31,18.05
ZX  (via drill 0.38)
  Top 0.254: U9.1 35.2,9.31 v35.14,9.37
ZX_I  (via drill 0.35)
  Top 0.254: U9.21 36.85,14.87 v36.51,15.21

### Text on the board
tPlace: INV | NORM | ZX_I | CF1 | CF2 | ZX
tNames: GND | SEL | GND | VP | 3.3V | RST | VN | IRQ | MOSI | I2N | SCK | I2P | MISO | I1N | CS | I1P
bNames: Watt Meter Rev.4 | CalPlug, UCI | Modified By Yaxin Deng